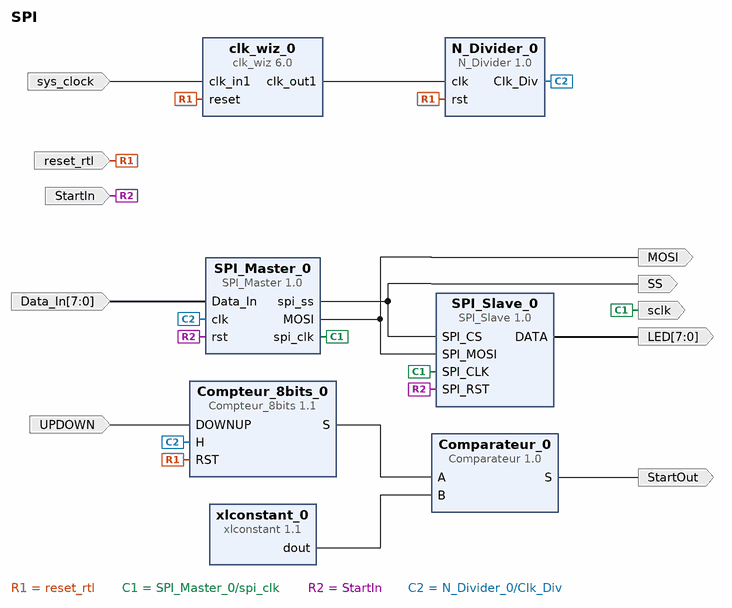
[diagram p0: block diagram of the top level]
# Vivado block design SPI, xc7z020clg484-1, Vivado 2018.3
create_bd_design SPI

create_bd_port -dir I -type rst reset_rtl
set_property -dict {CONFIG.POLARITY ACTIVE_HIGH} [get_bd_ports reset_rtl]
create_bd_port -dir I -type clk sys_clock
set_property -dict {CONFIG.FREQ_HZ 100000000 CONFIG.PHASE 0.000} [get_bd_ports sys_clock]
create_bd_port -dir I -from 7 -to 0 Data_In
create_bd_port -dir O sclk
create_bd_port -dir O SS
create_bd_port -dir O MOSI
create_bd_port -dir I UPDOWN
create_bd_port -dir O StartOut
create_bd_port -dir I StartIn
create_bd_port -dir O -from 7 -to 0 LED

create_bd_cell -type ip -vlnv xilinx.com:ip:clk_wiz:6.0 clk_wiz_0
set_property -dict [list \
  CONFIG.CLKOUT1_JITTER 290.478 \
  CONFIG.CLKOUT1_PHASE_ERROR 133.882 \
  CONFIG.CLKOUT1_REQUESTED_OUT_FREQ 10 \
  CONFIG.CLK_IN1_BOARD_INTERFACE sys_clock \
  CONFIG.MMCM_CLKFBOUT_MULT_F 15.625 \
  CONFIG.MMCM_CLKOUT0_DIVIDE_F 78.125 \
  CONFIG.MMCM_DIVCLK_DIVIDE 2 \
  CONFIG.USE_BOARD_FLOW true \
] [get_bd_cells clk_wiz_0]
create_bd_cell -type ip -vlnv xilinx.com:user:N_Divider:1.0 N_Divider_0
set_property -dict {CONFIG.N 10} [get_bd_cells N_Divider_0]
create_bd_cell -type ip -vlnv xilinx.com:ip:xlconstant:1.1 xlconstant_0
set_property -dict {CONFIG.CONST_VAL 25 CONFIG.CONST_WIDTH 8} [get_bd_cells xlconstant_0]
create_bd_cell -type ip -vlnv xilinx.com:user:Compteur_8bits:1.1 Compteur_8bits_0
set_property -dict {CONFIG.N 8} [get_bd_cells Compteur_8bits_0]
create_bd_cell -type ip -vlnv xilinx.com:user:Comparateur:1.0 Comparateur_0
set_property -dict {CONFIG.n 8} [get_bd_cells Comparateur_0]
create_bd_cell -type ip -vlnv xilinx.com:user:SPI_Master:1.0 SPI_Master_0
set_property -dict {CONFIG.n 8} [get_bd_cells SPI_Master_0]
create_bd_cell -type ip -vlnv xilinx.com:user:SPI_Slave:1.0 SPI_Slave_0

# ---- connections ----

connect_bd_net [get_bd_ports reset_rtl] [get_bd_pins clk_wiz_0/reset] [get_bd_pins N_Divider_0/rst] [get_bd_pins Compteur_8bits_0/RST]
connect_bd_net [get_bd_ports sys_clock] [get_bd_pins clk_wiz_0/clk_in1]
connect_bd_net [get_bd_pins SPI_Master_0/spi_clk] [get_bd_ports sclk] [get_bd_pins SPI_Slave_0/SPI_CLK]
connect_bd_net [get_bd_pins SPI_Master_0/spi_ss] [get_bd_ports SS] [get_bd_pins SPI_Slave_0/SPI_CS]
connect_bd_net [get_bd_pins SPI_Master_0/MOSI] [get_bd_ports MOSI] [get_bd_pins SPI_Slave_0/SPI_MOSI]
connect_bd_net [get_bd_pins Compteur_8bits_0/S] [get_bd_pins Comparateur_0/A]
connect_bd_net [get_bd_pins xlconstant_0/dout] [get_bd_pins Comparateur_0/B]
connect_bd_net [get_bd_ports UPDOWN] [get_bd_pins Compteur_8bits_0/DOWNUP]
connect_bd_net [get_bd_pins clk_wiz_0/clk_out1] [get_bd_pins N_Divider_0/clk]
connect_bd_net [get_bd_pins Comparateur_0/S] [get_bd_ports StartOut]
connect_bd_net [get_bd_ports StartIn] [get_bd_pins SPI_Master_0/rst] [get_bd_pins SPI_Slave_0/SPI_RST]
connect_bd_net [get_bd_pins N_Divider_0/Clk_Div] [get_bd_pins Compteur_8bits_0/H] [get_bd_pins SPI_Master_0/clk]
connect_bd_net [get_bd_pins SPI_Slave_0/DATA] [get_bd_ports LED]
connect_bd_net [get_bd_ports Data_In] [get_bd_pins SPI_Master_0/Data_In]

validate_bd_design
save_bd_design
